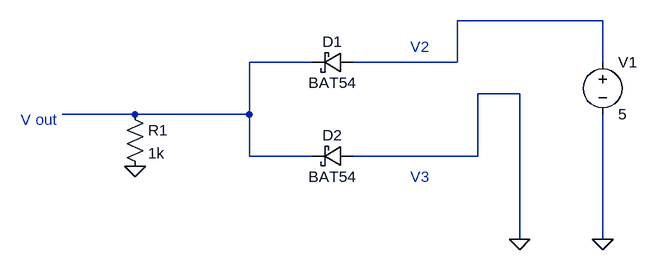
[diagram p0: schematic OR gate.asc]
OR gate.asc, the LTspice schematic file:
Version 4
SHEET 1 880 680
WIRE 560 16 336 16
WIRE 112 80 16 80
WIRE 336 80 336 16
WIRE 336 80 176 80
WIRE 560 80 560 16
WIRE 432 128 368 128
WIRE -160 160 -272 160
WIRE 16 160 16 80
WIRE 16 160 -160 160
WIRE 16 224 16 160
WIRE 112 224 16 224
WIRE 368 224 368 128
WIRE 368 224 176 224
WIRE 432 352 432 128
WIRE 560 352 560 160
FLAG -160 240 0
FLAG 432 352 0
FLAG 560 352 0
SYMBOL schottky 176 64 R90
WINDOW 0 0 32 VBottom 2
WINDOW 3 32 32 VTop 2
SYMATTR InstName D1
SYMATTR Value BAT54
SYMBOL schottky 176 208 R90
WINDOW 0 0 32 VBottom 2
WINDOW 3 32 32 VTop 2
SYMATTR InstName D2
SYMATTR Value BAT54
SYMBOL res -176 144 R0
SYMATTR InstName R1
SYMATTR Value 1k
SYMBOL voltage 560 64 R0
WINDOW 123 0 0 Left 0
WINDOW 39 0 0 Left 0
SYMATTR InstName V1
SYMATTR Value 5
TEXT -336 168 Left 2 ;V out
TEXT 264 56 Left 2 ;V2
TEXT 264 256 Left 2 ;V3

The netlist it stands for:
* OR gate.asc
D1 N001 N002 BAT54
D2 0 N002 BAT54
R1 N002 0 1k
V1 N001 0 5
.model D D
.lib standard.dio
* V out
* V2
* V3
.backanno
.end